# Altium schematic sheet 5VSupply.SchDoc
size A
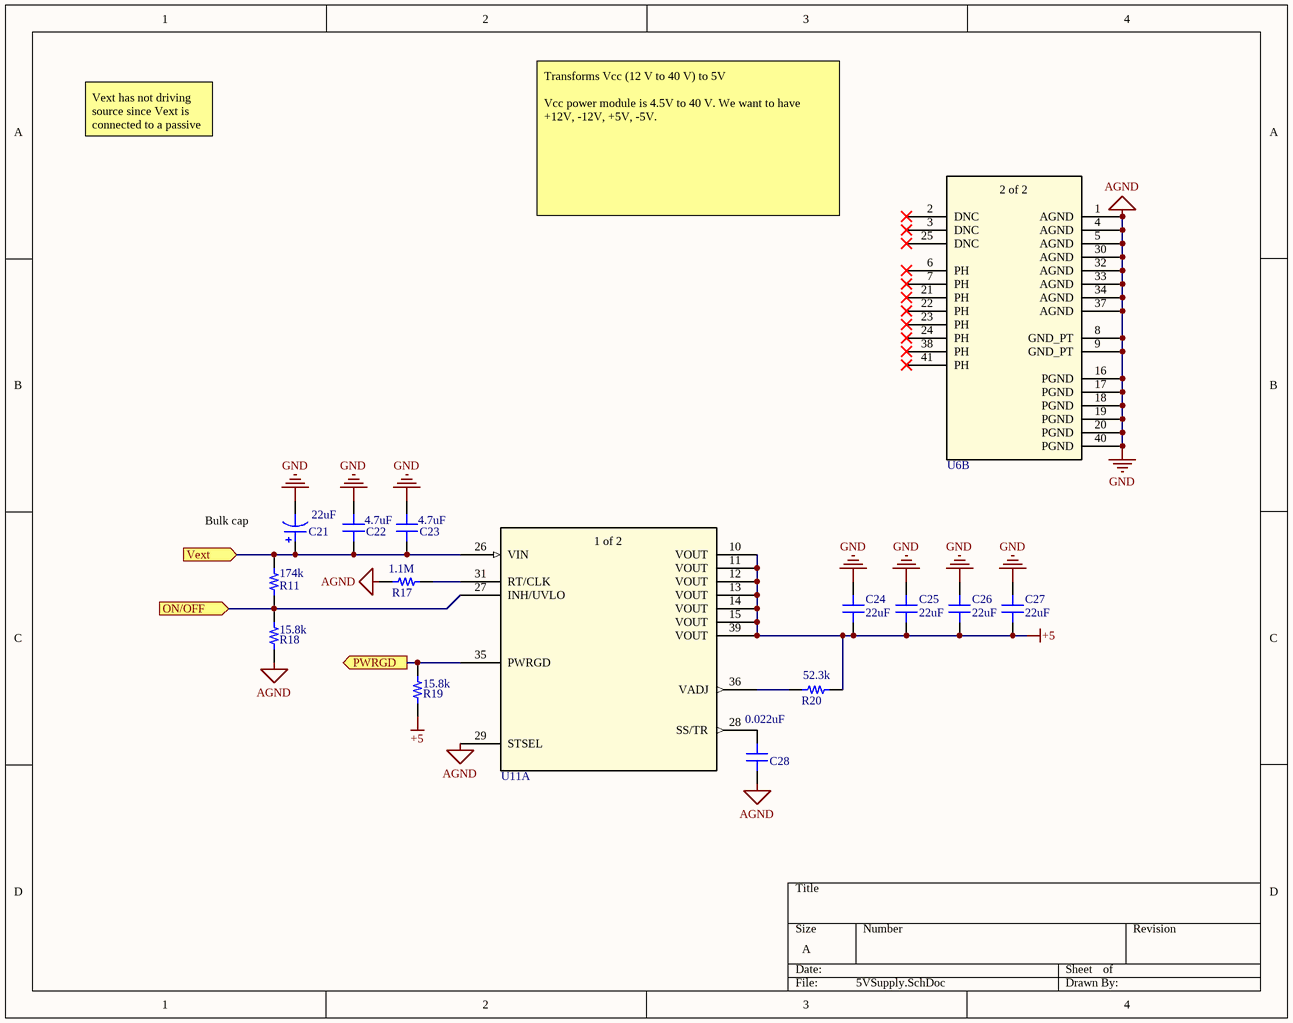
[diagram p0: 5VSupply.SchDoc]

## Parts
C21  22uF  [CAP AL TH D8 L3.5 H11.5]
C22  4.7uF  [CAP 1206/3216 - 1.0MM]
C23  4.7uF  [CAP 1206/3216 - 1.0MM]
C24  22uF  [CAP 1206/3216]
C25  22uF  [CAP 1206/3216]
C26  22uF  [CAP 1206/3216]
C27  22uF  [CAP 1206/3216]
C28  0.022uF  [CAP 0805/2012]
R11  174k  [RES 0805/2012]
R17  1.1M  [RES 0603/1608]
R18  15.8k  [RES 0805/2012]
R19  15.8k  [RES 0805/2012]
R20  52.3k  [RES 0603/1608]
U6  LMZ34003  [RKG41]  (value not drawn)  (part B of 2)
U11  LMZ35003RKGR  [RKG41]  (value not drawn)  (part A of 2)

## Ports
ON/OFF (in), PWRGD (out), Vext (in)

## Nets
+5: C24.2 C25.2 C26.2 C27.2 R19.1 R20.2 U11.10(VOUT) U11.11(VOUT) U11.12(VOUT) U11.13(VOUT) U11.14(VOUT) U11.15(VOUT) U11.39(VOUT)
AGND: C21.2 C22.2 C23.2 C24.1 C25.1 C26.1 C27.1 C28.1 R17.1 R18.1 U6.1(AGND) U6.4(AGND) U6.5(AGND) U6.8(GND_PT) U6.9(GND_PT) U6.16(PGND) U6.17(PGND) U6.18(PGND) U6.19(PGND) U6.20(PGND) U6.30(AGND) U6.32(AGND) U6.33(AGND) U6.34(AGND) U6.37(AGND) U6.40(PGND) U11.29(STSEL)  [also labelled GND]
ON/OFF: R11.1 R18.2 U11.27(INH/UVLO) ; port ON/OFF
PWRGD: R19.2 U11.35(PWRGD) ; port PWRGD
Vext: C21.1 C22.1 C23.1 R11.2 U11.26(VIN) ; port Vext
NetC28_2: C28.2 U11.28(SS/TR)
NetR17_2: R17.2 U11.31(RT/CLK)
NetR20_1: R20.1 U11.36(VADJ)

Not connected (* = marked no-connect by the designer): U6 2(DNC)* 3(DNC)* 6(PH)* 7(PH)* 21(PH)* 22(PH)* 23(PH)* 24(PH)* 25(DNC)* 38(PH)* 41(PH)*

## Notes on the sheet
- Vext has not driving source since Vext is connected to a passive connector. The connector is the driving source.
- Transforms Vcc (12 V to 40 V) to 5V
  Vcc power module is 4.5V to 40 V. We want to have +12V, -12V, +5V, -5V.
- Bulk cap
- (in symbol LMZ34003, part A) 1 of 2
- (in symbol LMZ34003, part B) 2 of 2

## Library data of the parts
C21 = EEU-FC2A220: CAP ALUM 22UF 20% 100V RADIAL; Manufacturer: Panasonic Electronic Components; TemperatureRange: -55°C ~ 105°C; Type: Automotive; Ripple Current: 169mA; Lifetime @ Temp: 2000 Hrs @ 105°C; Value: 22uF; Part Number: EEU-FC2A220; PartId: 7484; Supplier 1: Digi-Key; Supplier Part Number 1: P10770-ND; ComponentLink1Description: Datasheet; ComponentLink1URL: https://industrial.panasonic.com/ww/products/capacitors/aluminum-capacitors/aluminum-cap-lead/fc/EEUFC2A220; ComponentLink2Description: Digi-Key listing; ComponentLink2URL: https://www.digikey.com/product-detail/en/panasonic-electronic-components/EEU-FC2A220/P10770-ND/285722; Tolerance: 20%; Voltage: 100V; Price: 0.46; Device Package: Radial, Can - TH
C22 C23 = C3216X5R1H475K085AB: CAP CER 4.7UF 50V X5R 1206; Manufacturer: TDK Corporation; TemperatureRange: -55C ~ 85C; Tolerance: 10%; Value: 4.7uF; Part Number: C3216X5R1H475K085AB; PartId: 17022; Supplier 1: Digi-Key; Supplier Part Number 1: 445-14692-2-ND; ComponentLink1Description: Datasheet; ComponentLink1URL: https://product.tdk.com/info/en/catalog/datasheets/mlcc_commercial_general_en.pdf; ComponentLink2Description: Digi-Key Listing; ComponentLink2URL: https://www.digikey.com/product-detail/en/tdk-corporation/C3216X5R1H475K085AB/445-14692-2-ND/3951928; TemperatureCoefficient: X5R; Voltage: 50V; Price: 0.3159; Device Package: 1206 (3216 Metric)
C24-C27 = CL31A226KAHNNNE: CAP CER 22UF 25V X5R 1206; Manufacturer: Samsung Electro-Mechanics America, Inc.; TemperatureRange: -55C ~ 85C; Tolerance: 10%; Value: 22uF; Part Number: CL31A226KAHNNNE; PartId: 15794; Supplier 1: Digi-Key; Supplier Part Number 1: 1276-3047-2-ND; ComponentLink1Description: Datasheet; ComponentLink1URL: //media.digikey.com/pdf/Data%20Sheets/Samsung%20PDFs/CL31A226KAHNNNE_Spec.pdf; ComponentLink2Description: Digi-Key Listing; ComponentLink2URL: https://www.digikey.com/product-detail/en/samsung-electro-mechanics-america-inc/CL31A226KAHNNNE/1276-3047-2-ND/3888705; TemperatureCoefficient: X5R; Voltage: 25V; Price: 0.1785; Device Package: 1206 (3216 Metric)
C28 = C0805S223K1RAC7800: CAP CER 0.022UF 100V X7R 0805; Manufacturer: Kemet; TemperatureRange: -55C ~ 125C; Tolerance: 10%; Value: 0.022uF; Part Number: C0805S223K1RAC7800; PartId: 14304; Supplier 1: Digi-Key; Supplier Part Number 1: 399-13176-2-ND; ComponentLink1Description: Datasheet; ComponentLink1URL: http://www.kemet.com/docfinder?Partnumber=C0805S223K1RACTU; ComponentLink2Description: Digi-Key Listing; ComponentLink2URL: https://www.digikey.com/product-detail/en/kemet/C0805S223K1RAC7800/399-13176-2-ND/2213362; TemperatureCoefficient: X7R; Voltage: 100V; Price: 0.071; Device Package: 0805 (2012 Metric)
R11 = ERJ-6ENF1743V: RES SMD 174K OHM 1% 1/8W 0805; Manufacturer: Panasonic Electronic Components; TemperatureRange: -55C ~ 155C; TemperatureCoefficient: 100ppm/C; PowerRating: 0.125W, 1/8W; Value: 174k; Part Number: ERJ-6ENF1743V; PartId: 2344; Supplier 1: Digi-Key; Supplier Part Number 1: P174KCTR-ND; ComponentLink1Description: Datasheet; ComponentLink1URL: http://industrial.panasonic.com/www-cgi/jvcr13pz.cgi?E+PZ+3+AOA0002+ERJ6ENF1743V+7+WW; ComponentLink2Description: Digi-Key listing; ComponentLink2URL: http://digikey.com/product-detail/en/ERJ-6ENF1743V/P174KCTR-ND/111921; Tolerance: 1%; Price: 0.0073; Type: Thick Film; Device Package: 0805 (2012 Metric)
R17 = ERJ-3EKF1104V: RES SMD 1.1M OHM 1% 1/10W 0603; Manufacturer: Panasonic Electronic Components; TemperatureRange: -55C ~ 155C; TemperatureCoefficient: 100ppm/C; PowerRating: 0.1W, 1/10W; Value: 1.1M; Part Number: ERJ-3EKF1104V; PartId: 1352; Supplier 1: Digi-Key; Supplier Part Number 1: P1.10MHTR-ND; ComponentLink1Description: Datasheet; ComponentLink1URL: http://industrial.panasonic.com/www-cgi/jvcr17pz.cgi?E+PZ+3+AOA0002+ERJ3EKF1101V+WW; ComponentLink2Description: Digi-Key listing; ComponentLink2URL: http://digikey.com/product-detail/en/ERJ-3EKF1104V/P1.10MHTR-ND/282702; Tolerance: 1%; Price: 0.0038; Type: Thick Film; Device Package: 0603 (1608 Metric)
R18 R19 = ERJ-6ENF1582V: RES SMD 15.8K OHM 1% 1/8W 0805; Manufacturer: Panasonic Electronic Components; TemperatureRange: -55C ~ 155C; TemperatureCoefficient: 100ppm/C; PowerRating: 0.125W, 1/8W; Value: 15.8k; Part Number: ERJ-6ENF1582V; PartId: 2101; Supplier 1: Digi-Key; Supplier Part Number 1: P15.8KCTR-ND; ComponentLink1Description: Datasheet; ComponentLink1URL: http://industrial.panasonic.com/www-cgi/jvcr13pz.cgi?E+PZ+3+AOA0002+ERJ6ENF1582V+7+WW; ComponentLink2Description: Digi-Key listing; ComponentLink2URL: http://digikey.com/product-detail/en/ERJ-6ENF1582V/P15.8KCTR-ND/6419; Tolerance: 1%; Price: 0.0073; Type: Thick Film; Device Package: 0805 (2012 Metric)
R20 = ERA-3AEB5232V: RES SMD 52.3KOHM 0.1% 1/10W 0603; Manufacturer: Panasonic Electronic Components; TemperatureRange: -55C ~ 155C; TemperatureCoefficient: 25ppm/C; PowerRating: 0.1W, 1/10W; Value: 52.3k; Part Number: ERA-3AEB5232V; PartId: 1573; Supplier 1: Digi-Key; Supplier Part Number 1: P52.3KDBTR-ND; ComponentLink1Description: Datasheet; ComponentLink1URL: http://industrial.panasonic.com/lecs/www-data/pdf/AOA0000/AOA0000CE26.pdf; ComponentLink2Description: Digi-Key listing; ComponentLink2URL: http://digikey.com/product-detail/en/ERA-3AEB5232V/P52.3KDBTR-ND/2026903; Tolerance: 0.1%; Price: 0.0653; Type: Thin Film; Device Package: 0603 (1608 Metric)
U6 U11 = LMZ34003: DC DC CONVERTER 2.5-15V 38W; Manufacturer_Part_Number: LMZ34002RKGT; Vendor: Texas Instruments; Built_By: EMA_UL_Team; Output Configuration: Positive; Topology: Buck, Buck-Boost; Output Type: Adjustable; Number Of Outputs: 1; Voltage - Input (Min): 7V; Voltage - Input (Max): 50V; Voltage - Output (Min/Fixed): 2.5V; Voltage - Output (Max): 15V; Current Output: 2.5A; Frequency - Switching: 800kHz; Synchronous Rectifier: No; Copyright: Copyright (C) 2018 Accelerated Designs. All rights reserved; RefDes: RefDes; Type: Non-Isolated PoL Module; Value: Value; Part Number: LMZ34003; PartId: 16768; Manufacturer: Texas Instruments; Supplier 1: Digi-Key; Supplier Part Number 1: 296-43647-1-ND; ComponentLink1Description: Datasheet; ComponentLink1URL: http://www.ti.com/lit/ds/symlink/lmz35003.pdf; ComponentLink2Description: Digi-Key Listing; ComponentLink2URL: https://www.digikey.com/product-detail/en/texas-instruments/LMZ35003RKGR/296-43647-1-ND/5864851; Device Package: 41-B1QFN (11x9); Price: 11.89; Series: SIMPLE SWITCHER®; Operating Temperature: -40°C ~ 85°C